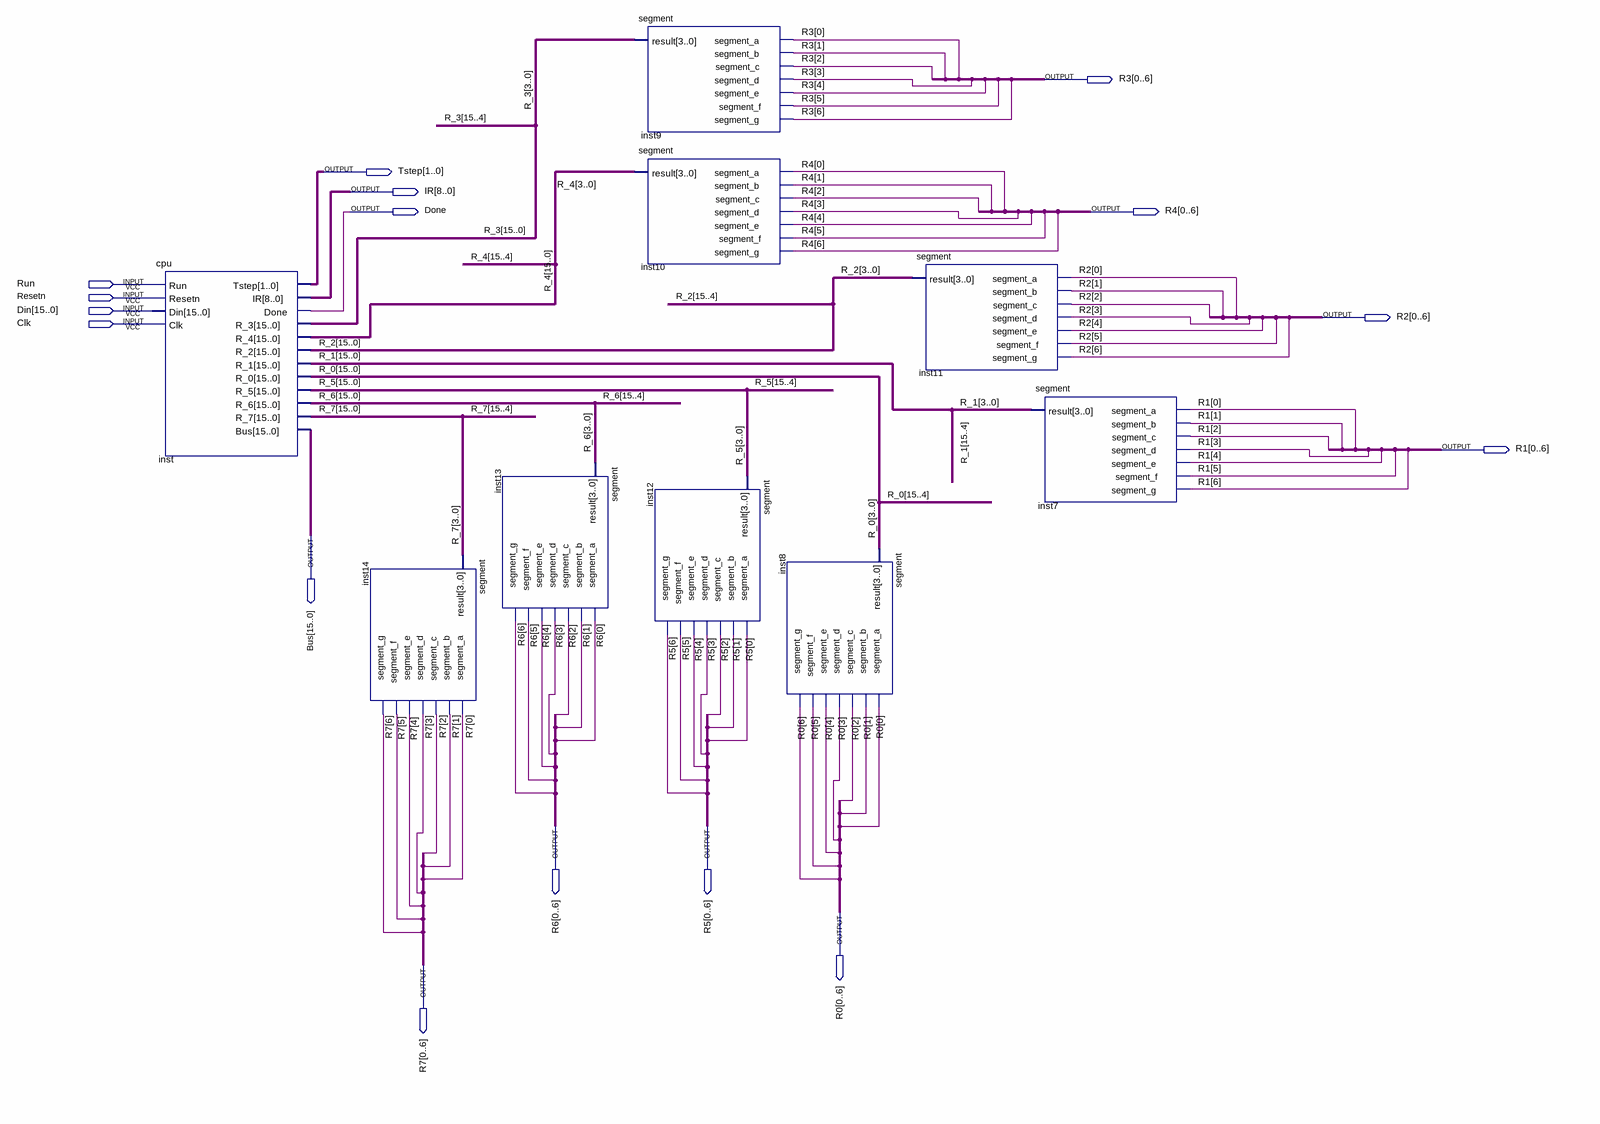
[diagram p0: schematic sheet]
// Quartus schematic cpu2.bdf as structural Verilog: 9 symbols, 16 pins
module cpu2 (
  input  Run,
  input  Resetn,
  input  [15:0] Din,
  input  Clk,
  output [0:6] R3,
  output [1:0] Tstep,
  output [8:0] IR,
  output Done,
  output [0:6] R4,
  output [0:6] R2,
  output [0:6] R1,
  output [15:0] Bus,
  output [0:6] R6,
  output [0:6] R5,
  output [0:6] R0,
  output [0:6] R7
);

  wire [15:0] R_0, R_1, R_2, R_3, R_4, R_5, R_6, R_7;

  cpu inst (
    .Run(Run), .Resetn(Resetn), .Din(Din), .Clk(Clk), .Tstep(Tstep), .IR(IR), .Done(Done), .R_3(R_3),
    .R_4(R_4), .R_2(R_2), .R_1(R_1), .R_0(R_0), .R_5(R_5), .R_6(R_6), .R_7(R_7), .Bus(Bus));
  segment inst14 (
    .result(R_7[3:0]), .segment_a(R7[0]), .segment_b(R7[1]), .segment_c(R7[2]), .segment_d(R7[3]),
    .segment_e(R7[4]), .segment_f(R7[5]), .segment_g(R7[6]));
  segment inst13 (
    .result(R_6[3:0]), .segment_a(R6[0]), .segment_b(R6[1]), .segment_c(R6[2]), .segment_d(R6[3]),
    .segment_e(R6[4]), .segment_f(R6[5]), .segment_g(R6[6]));
  segment inst9 (
    .result(R_3[3:0]), .segment_a(R3[0]), .segment_b(R3[1]), .segment_c(R3[2]), .segment_d(R3[3]),
    .segment_e(R3[4]), .segment_f(R3[5]), .segment_g(R3[6]));
  segment inst10 (
    .result(R_4[3:0]), .segment_a(R4[0]), .segment_b(R4[1]), .segment_c(R4[2]), .segment_d(R4[3]),
    .segment_e(R4[4]), .segment_f(R4[5]), .segment_g(R4[6]));
  segment inst12 (
    .result(R_5[3:0]), .segment_a(R5[0]), .segment_b(R5[1]), .segment_c(R5[2]), .segment_d(R5[3]),
    .segment_e(R5[4]), .segment_f(R5[5]), .segment_g(R5[6]));
  segment inst8 (
    .result(R_0[3:0]), .segment_a(R0[0]), .segment_b(R0[1]), .segment_c(R0[2]), .segment_d(R0[3]),
    .segment_e(R0[4]), .segment_f(R0[5]), .segment_g(R0[6]));
  segment inst11 (
    .result(R_2[3:0]), .segment_a(R2[0]), .segment_b(R2[1]), .segment_c(R2[2]), .segment_d(R2[3]),
    .segment_e(R2[4]), .segment_f(R2[5]), .segment_g(R2[6]));
  segment inst7 (
    .result(R_1[3:0]), .segment_a(R1[0]), .segment_b(R1[1]), .segment_c(R1[2]), .segment_d(R1[3]),
    .segment_e(R1[4]), .segment_f(R1[5]), .segment_g(R1[6]));
endmodule
